# Altium schematic sheet STM32H730_PINOUT.SchDoc
size C; SheetNumber: 3; SheetTotal: 9
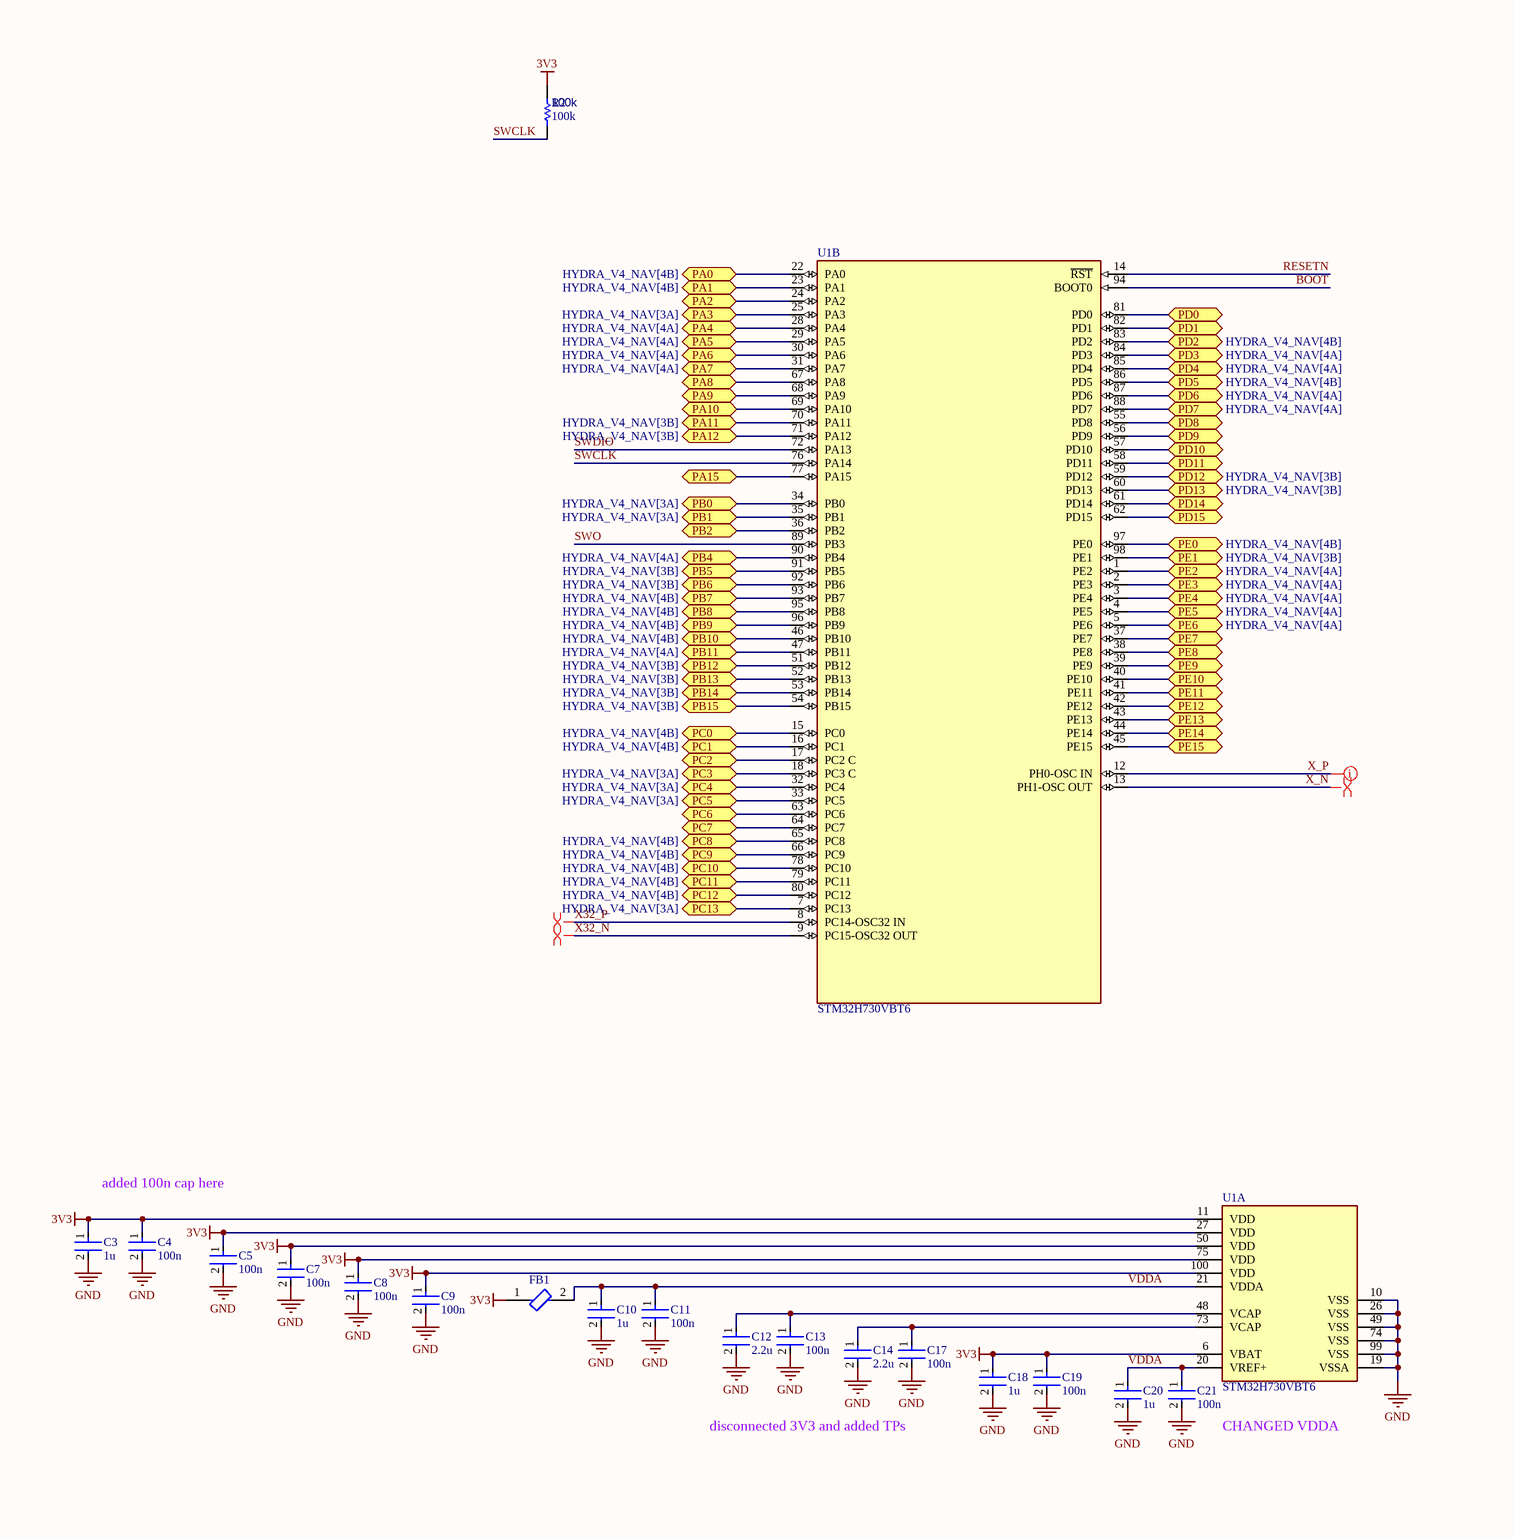
[diagram p0: STM32H730_PINOUT.SchDoc, left]
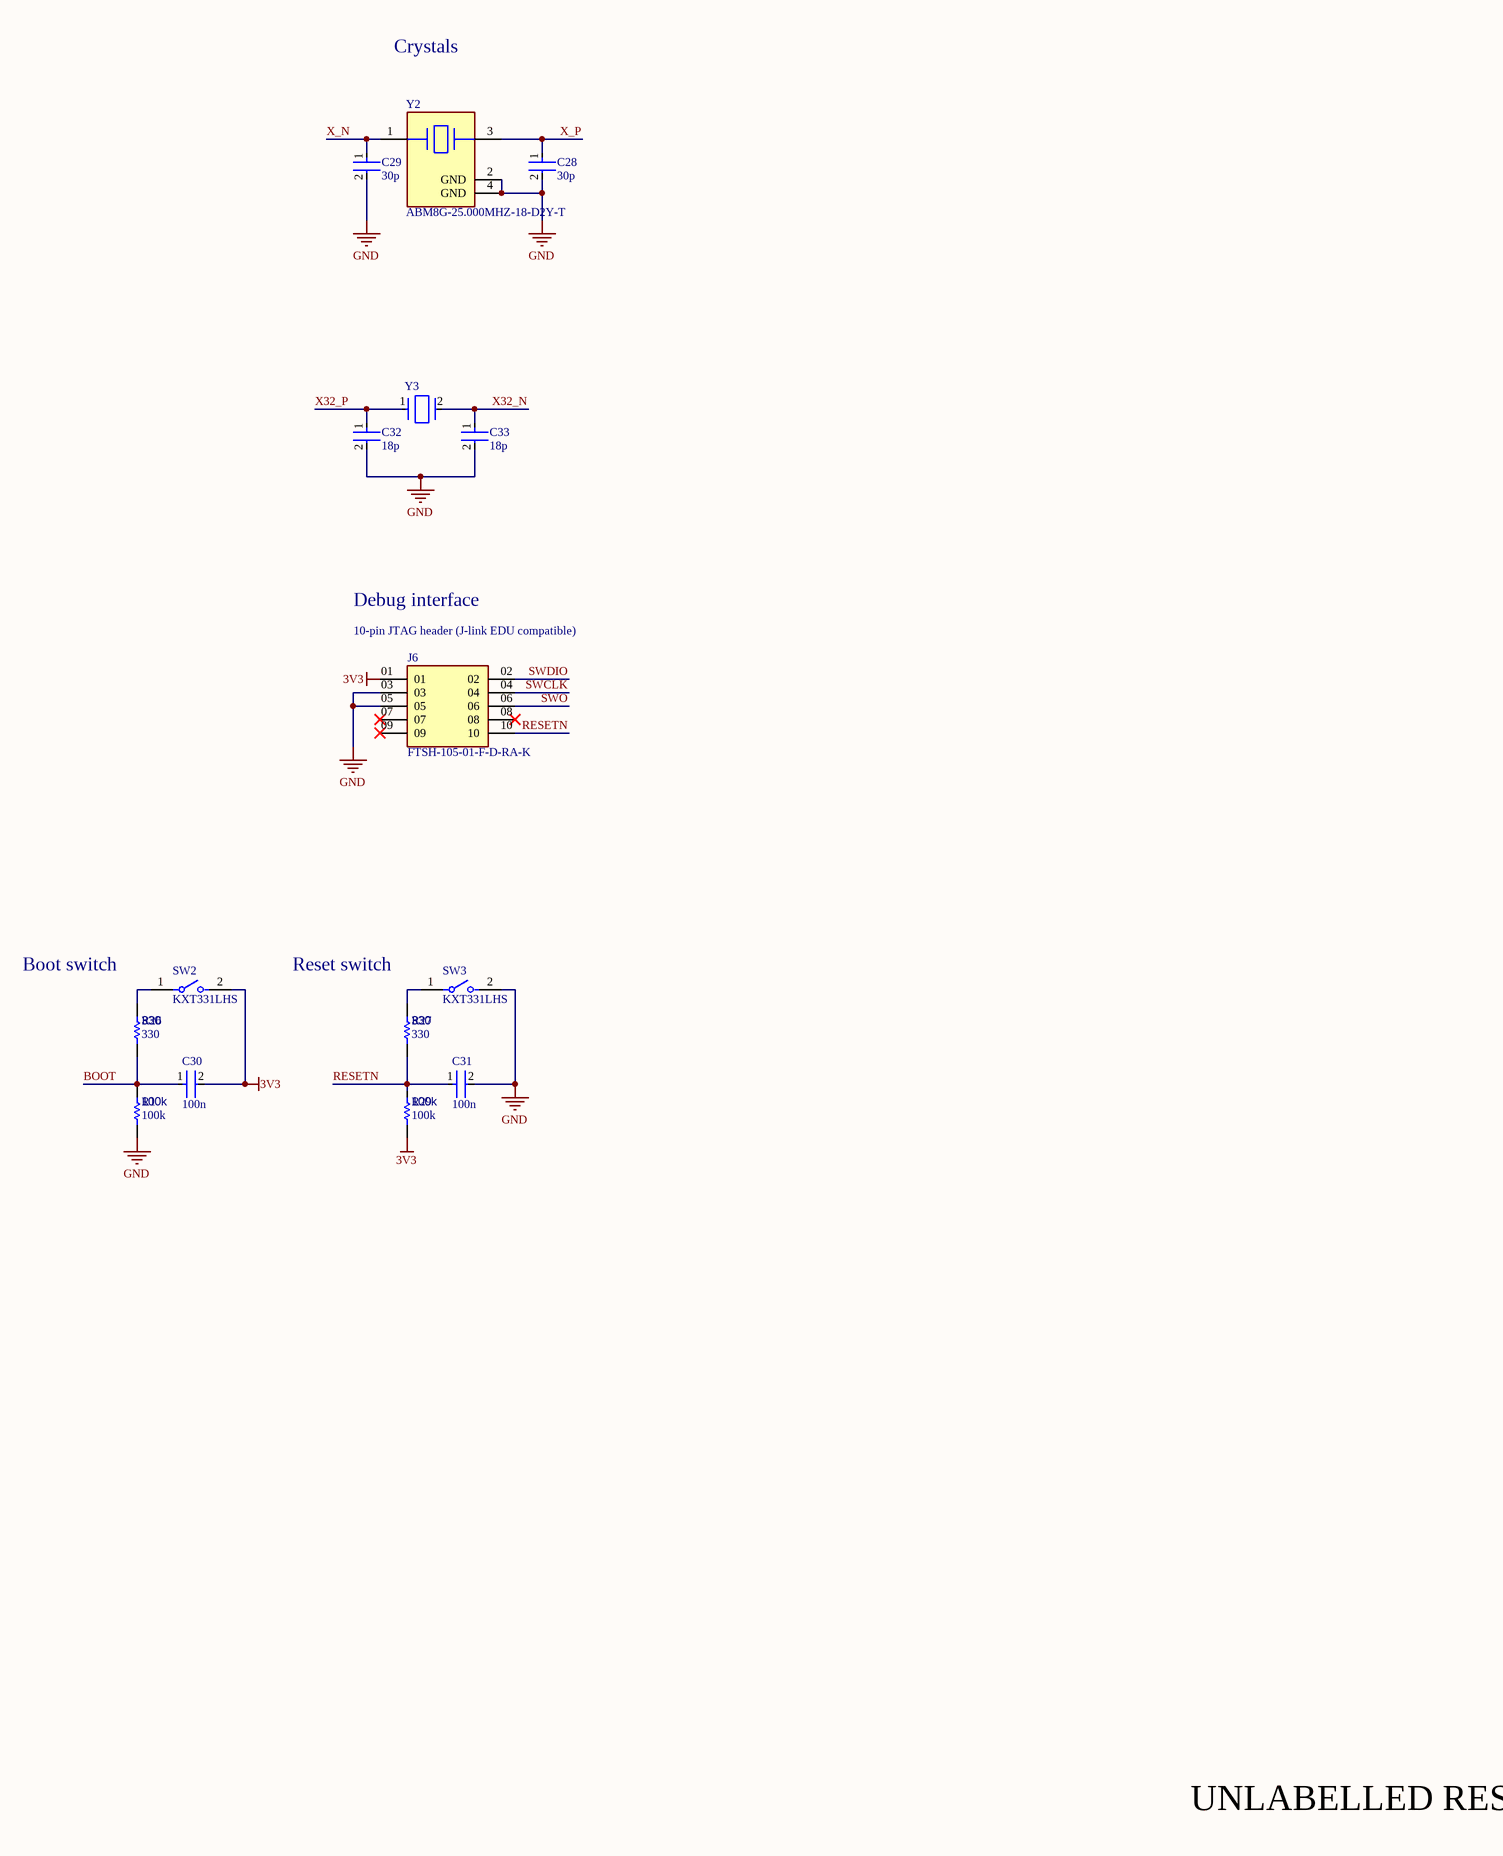
[diagram p1: STM32H730_PINOUT.SchDoc, right]

## Parts
C3  1u  [FP-0402-L_1_0_0_05-W_0_5-IPC_A]
C4  100n  [FP-0402-L_1_0_0_05-W_0_5-IPC_A]
C5  100n  [FP-0402-L_1_0_0_05-W_0_5-IPC_A]
C7  100n  [FP-0402-L_1_0_0_05-W_0_5-IPC_A]
C8  100n  [FP-0402-L_1_0_0_05-W_0_5-IPC_A]
C9  100n  [FP-0402-L_1_0_0_05-W_0_5-IPC_A]
C10  1u  [FP-0402-L_1_0_0_05-W_0_5-IPC_A]
C11  100n  [FP-0402-L_1_0_0_05-W_0_5-IPC_A]
C12  2.2u  [FP-0402-L_1_0_0_05-W_0_5-IPC_A]
C13  100n  [FP-0402-L_1_0_0_05-W_0_5-IPC_A]
C14  2.2u  [FP-0402-L_1_0_0_05-W_0_5-IPC_A]
C17  100n  [FP-0402-L_1_0_0_05-W_0_5-IPC_A]
C18  1u  [FP-0402-L_1_0_0_05-W_0_5-IPC_A]
C19  100n  [FP-0402-L_1_0_0_05-W_0_5-IPC_A]
C20  1u  [FP-0402-L_1_0_0_05-W_0_5-IPC_A]
C21  100n  [FP-0402-L_1_0_0_05-W_0_5-IPC_A]
C28  30p  [FP-0402-L_1_0_0_05-W_0_5-IPC_A]
C29  30p  [FP-0402-L_1_0_0_05-W_0_5-IPC_A]
C30  100n  [FP-0402-L_1_0_0_05-W_0_5-IPC_A]
C31  100n  [FP-0402-L_1_0_0_05-W_0_5-IPC_A]
C32  18p  [FP-0402-L_1_0_0_05-W_0_5-IPC_A]
C33  18p  [FP-0402-L_1_0_0_05-W_0_5-IPC_A]
FB1  BLM15PX601SN1D  [FP-BLM15-0_05-MFG]  (value not drawn)
J6  FTSH-105-01-F-D-RA-K  [FTSH-105-01-F-D-RA-K-Footprint-1]
R1  100k  [R0603B]
R2  100k  [R0603B]
R26  330  [R0603B]
R27  330  [R0603B]
R29  100k  [R0603B]
SW2  KXT331LHS  [FP-KXT331LHS-MFG]
SW3  KXT331LHS  [FP-KXT331LHS-MFG]
U1  STM32H730VBT6  [FP-LQFP100-1L-IPC_C]  (parts A,B of 2)
Y2  ABM8G-25.000MHZ-18-D2Y-T  [FP-ABM8G-MFG]
Y3  ECS-.327-12.5-1210-TR  [FP-ECX-1210-MFG]  (value not drawn)

## Ports
PA0 (bidir, see HYDRA_V4_NAV[4B]), PA1 (bidir, see HYDRA_V4_NAV[4B]), PA2 (bidir), PA3 (bidir, see HYDRA_V4_NAV[3A]), PA4 (bidir, see HYDRA_V4_NAV[4A]), PA5 (bidir, see HYDRA_V4_NAV[4A]), PA6 (bidir, see HYDRA_V4_NAV[4A]), PA7 (bidir, see HYDRA_V4_NAV[4A]), PA8 (bidir), PA9 (bidir), PA10 (bidir), PA11 (bidir, see HYDRA_V4_NAV[3B]), PA12 (bidir, see HYDRA_V4_NAV[3B]), PA15 (bidir), PB0 (bidir, see HYDRA_V4_NAV[3A]), PB1 (bidir, see HYDRA_V4_NAV[3A]), PB2 (bidir), PB4 (bidir, see HYDRA_V4_NAV[4A]), PB5 (bidir, see HYDRA_V4_NAV[3B]), PB6 (bidir, see HYDRA_V4_NAV[3B]), PB7 (bidir, see HYDRA_V4_NAV[4B]), PB8 (bidir, see HYDRA_V4_NAV[4B]), PB9 (bidir, see HYDRA_V4_NAV[4B]), PB10 (bidir, see HYDRA_V4_NAV[4B]), PB11 (bidir, see HYDRA_V4_NAV[4A]), PB12 (bidir, see HYDRA_V4_NAV[3B]), PB13 (bidir, see HYDRA_V4_NAV[3B]), PB14 (bidir, see HYDRA_V4_NAV[3B]), PB15 (bidir, see HYDRA_V4_NAV[3B]), PC0 (bidir, see HYDRA_V4_NAV[4B]), PC1 (bidir, see HYDRA_V4_NAV[4B]), PC2 (bidir), PC3 (bidir, see HYDRA_V4_NAV[3A]), PC4 (bidir, see HYDRA_V4_NAV[3A]), PC5 (bidir, see HYDRA_V4_NAV[3A]), PC6 (bidir), PC7 (bidir), PC8 (bidir, see HYDRA_V4_NAV[4B]), PC9 (bidir, see HYDRA_V4_NAV[4B]), PC10 (bidir, see HYDRA_V4_NAV[4B]), PC11 (bidir, see HYDRA_V4_NAV[4B]), PC12 (bidir, see HYDRA_V4_NAV[4B]), PC13 (bidir, see HYDRA_V4_NAV[3A]), PD0 (bidir), PD1 (bidir), PD2 (bidir, see HYDRA_V4_NAV[4B]), PD3 (bidir, see HYDRA_V4_NAV[4A]), PD4 (bidir, see HYDRA_V4_NAV[4A]), PD5 (bidir, see HYDRA_V4_NAV[4B]), PD6 (bidir, see HYDRA_V4_NAV[4A]), PD7 (bidir, see HYDRA_V4_NAV[4A]), PD8 (bidir), PD9 (bidir), PD10 (bidir), PD11 (bidir), PD12 (bidir, see HYDRA_V4_NAV[3B]), PD13 (bidir, see HYDRA_V4_NAV[3B]), PD14 (bidir), PD15 (bidir), PE0 (bidir, see HYDRA_V4_NAV[4B]), PE1 (bidir, see HYDRA_V4_NAV[3B]), PE2 (bidir, see HYDRA_V4_NAV[4A]), PE3 (bidir, see HYDRA_V4_NAV[4A]), PE4 (bidir, see HYDRA_V4_NAV[4A]), PE5 (bidir, see HYDRA_V4_NAV[4A]), PE6 (bidir, see HYDRA_V4_NAV[4A]), PE7 (bidir), PE8 (bidir), PE9 (bidir), PE10 (bidir), PE11 (bidir), PE12 (bidir), PE13 (bidir), PE14 (bidir), PE15 (bidir)

## Nets
3V3: C3.1 C4.1 C5.1 C7.1 C8.1 C9.1 C18.1 C19.1 C30.2 FB1.1 J6.01 R2.1 R29.2 SW2.2 U1.6(VBAT) U1.11(VDD) U1.27(VDD) U1.50(VDD) U1.75(VDD) U1.100(VDD)
GND: C3.2 C4.2 C5.2 C7.2 C8.2 C9.2 C10.2 C11.2 C12.2 C13.2 C14.2 C17.2 C18.2 C19.2 C20.2 C21.2 C28.2 C29.2 C31.2 C32.2 C33.2 J6.03 J6.05 R1.2 SW3.2 U1.10(VSS) U1.19(VSSA) U1.26(VSS) U1.49(VSS) U1.74(VSS) U1.99(VSS) Y2.2(GND) Y2.4(GND)
BOOT: C30.1 R1.1 R26.2 U1.94(BOOT0)
PA0: U1.22(PA0) ; port PA0
PA1: U1.23(PA1) ; port PA1
PA2: U1.24(PA2) ; port PA2
PA3: U1.25(PA3) ; port PA3
PA4: U1.28(PA4) ; port PA4
PA5: U1.29(PA5) ; port PA5
PA6: U1.30(PA6) ; port PA6
PA7: U1.31(PA7) ; port PA7
PA8: U1.67(PA8) ; port PA8
PA9: U1.68(PA9) ; port PA9
PA10: U1.69(PA10) ; port PA10
PA11: U1.70(PA11) ; port PA11
PA12: U1.71(PA12) ; port PA12
PA15: U1.77(PA15) ; port PA15
PB0: U1.34(PB0) ; port PB0
PB1: U1.35(PB1) ; port PB1
PB2: U1.36(PB2) ; port PB2
PB4: U1.90(PB4) ; port PB4
PB5: U1.91(PB5) ; port PB5
PB6: U1.92(PB6) ; port PB6
PB7: U1.93(PB7) ; port PB7
PB8: U1.95(PB8) ; port PB8
PB9: U1.96(PB9) ; port PB9
PB10: U1.46(PB10) ; port PB10
PB11: U1.47(PB11) ; port PB11
PB12: U1.51(PB12) ; port PB12
PB13: U1.52(PB13) ; port PB13
PB14: U1.53(PB14) ; port PB14
PB15: U1.54(PB15) ; port PB15
PC0: U1.15(PC0) ; port PC0
PC1: U1.16(PC1) ; port PC1
PC2: U1.17(PC2_C) ; port PC2
PC3: U1.18(PC3_C) ; port PC3
PC4: U1.32(PC4) ; port PC4
PC5: U1.33(PC5) ; port PC5
PC6: U1.63(PC6) ; port PC6
PC7: U1.64(PC7) ; port PC7
PC8: U1.65(PC8) ; port PC8
PC9: U1.66(PC9) ; port PC9
PC10: U1.78(PC10) ; port PC10
PC11: U1.79(PC11) ; port PC11
PC12: U1.80(PC12) ; port PC12
PC13: U1.7(PC13) ; port PC13
PD0: U1.81(PD0) ; port PD0
PD1: U1.82(PD1) ; port PD1
PD2: U1.83(PD2) ; port PD2
PD3: U1.84(PD3) ; port PD3
PD4: U1.85(PD4) ; port PD4
PD5: U1.86(PD5) ; port PD5
PD6: U1.87(PD6) ; port PD6
PD7: U1.88(PD7) ; port PD7
PD8: U1.55(PD8) ; port PD8
PD9: U1.56(PD9) ; port PD9
PD10: U1.57(PD10) ; port PD10
PD11: U1.58(PD11) ; port PD11
PD12: U1.59(PD12) ; port PD12
PD13: U1.60(PD13) ; port PD13
PD14: U1.61(PD14) ; port PD14
PD15: U1.62(PD15) ; port PD15
PE0: U1.97(PE0) ; port PE0
PE1: U1.98(PE1) ; port PE1
PE2: U1.1(PE2) ; port PE2
PE3: U1.2(PE3) ; port PE3
PE4: U1.3(PE4) ; port PE4
PE5: U1.4(PE5) ; port PE5
PE6: U1.5(PE6) ; port PE6
PE7: U1.37(PE7) ; port PE7
PE8: U1.38(PE8) ; port PE8
PE9: U1.39(PE9) ; port PE9
PE10: U1.40(PE10) ; port PE10
PE11: U1.41(PE11) ; port PE11
PE12: U1.42(PE12) ; port PE12
PE13: U1.43(PE13) ; port PE13
PE14: U1.44(PE14) ; port PE14
PE15: U1.45(PE15) ; port PE15
RESETN: C31.1 J6.10 R27.2 R29.1 U1.14(~{RST})
SWCLK: J6.04 R2.2 U1.76(PA14)
SWDIO: J6.02 U1.72(PA13)
SWO: J6.06 U1.89(PB3)
VDDA: C10.1 C11.1 C20.1 C21.1 FB1.2 U1.20(VREF+) U1.21(VDDA)
X32_N: C33.1 U1.9(PC15-OSC32_OUT) Y3.2(Out/In)
X32_P: C32.1 U1.8(PC14-OSC32_IN) Y3.1(In/Out)
X_N: C29.1 U1.13(PH1-OSC_OUT) Y2.1
X_P: C28.1 U1.12(PH0-OSC_IN) Y2.3
NetC12_1: C12.1 C13.1 U1.48(VCAP)
NetC14_1: C14.1 C17.1 U1.73(VCAP)
NetR26_1: R26.1 SW2.1
NetR27_1: R27.1 SW3.1

Not connected (* = marked no-connect by the designer): J6 07* 08* 09*

## Layout directives
differential pair: X32_N, X32_P, X_N, X_P

## Notes on the sheet
- Crystals
- Debug interface
- (near J6) 10-pin JTAG header (J-link EDU compatible)
- Boot switch
- Reset switch
- added 100n cap here
- disconnected 3V3 and added TPs
- CHANGED VDDA
- UNLABELLED RESISTORS ARE JUMPERS

## Library data of the parts
C3-C5 C7-C14 C17-C21 C28-C33 = CMP-001-00058-1: LARGE PADS, 0402 CAP, CHANGE COMMENT TO MATCH REAL P/N; Capacitor Type: Ceramic; Min Operating Temperature: -55°C; Mounting Technology: Surface Mount; Pins: 2; Case/Package: 0402; RoHS Compliant: Yes; Max Operating Temperature: 85°C
  C3 C10 C18 C20: Value: 1u
  C4 C5 C7-C9 C11 C13 C17 C19 C21 C30 C31: Value: 100n
  C12 C14: Value: 2.2u
  C28 C29: Value: 30p
  C32 C33: Value: 18p
FB1 = CMP-0686-00252-4: Chip Ferrite Bead, 0402, 600Ω @ 100MHz, 0.23Ω, 25%, 900mA; Number of Circuits: 1; Impedance: 600R; DC Resistance (DCR): 230mR; Material: Steel; Length: 1mm; Package Quantity: 10000; Height: 0.5mm; Width: 0.5mm; Max DC Current: 900mA; Number of Lines: 1; Termination: SMD/SMT; Packaging: Tape and Reel; Lead Free: Lead Free; Min Operating Temperature: -55°C; Max Operating Temperature: 125°C; Max Current Rating: 900mA; Case Code (Imperial): 0402; Number of Pins: 2; Current Rating: 900mA; Test Frequency: 100MHz; Case/Package: 0402; Tolerance: 25%; Case Code (Metric): 1005
J6 = CMP-002-00041-5: Board Connector, 10 Contact(s), 2 Row(s), Male, Right Angle, 0.05 inch Pitch, Surface Mount Terminal, Locking, Black Insulator; Connector Type: BOARD CONNECTOR; Mounting Technology: Board; RoHS Compliant: Yes
R1 R2 R26 R27 R29 = CMP-009-00002-14: Resistor
  R1 R2 R29: Value: 100k
  R26 R27: Value: 330
SW2 SW3 = CMP-10040-000029-1: SWITCH TACTILE SPST-NO 0.02A 15V; Operating Force: 240gf; Switch Travel: 0.13mm; Illumination Type: Non-Illuminated; Throw Configuration: SPST; Number of Ports: 1; Current Rating: 5A; Mechanical Life: 500000Cycles; Switch Function: Off-Mom; Connector Type: USB; Actuator Type: Standard; Gender: Receptacle; Number of Contacts: 24; Contact Plating: Gold; Insulation Color: Black; Min Operating Temperature: -40°C; Packaging: Tape and Reel; Flammability Rating: UL94 V-0; Max Operating Temperature: 85°C; Termination: Solder; Mount: Surface Mount
U1 = CMP-12105-000107-1: IC MCU 32BIT 128KB FLASH 100LQFP
Y2 = CMP-2000-05733-3: Crystal 25MHz ±20ppm (Tol) ±30ppm (Stability) 18pF FUND 60Ω 4-Pin SMD T/R; Series Resistance: 60R; Length: 3.2mm; Depth: 2.5mm; Packaging: Tape and Reel; Min Operating Temperature: -40°C; Operating Frequency: 25 MHz; Lead Free: Lead Free; Number of Pins: 4; Frequency Tolerance: 20ppm; Radiation Hardening: No; Max Operating Temperature: 85°C; Termination: SMD/SMT; Frequency Stability: 30ppm; Frequency: 25MHz; Series: ABM8G; Mount: Surface Mount; Package Quantity: 1000; Height: 0.039inch; Width: 0.098inch; Case/Package: CSMD; ESR (Equivalent Series Resistance): 60R; Load Capacitance: 18pF; Tolerance: 20ppm
Y3 = CMP-40224-000006-1: CRYSTAL 32.7680KHZ 12.5PF SMD; Manufacturer: ECS International; Frequency: 32.768kHz; Esr: 90kΩ; Tolerance: 20ppm; Device Class L1: Passive Components; Load Capacitance: 12.5pF; Temperature: -40°C to +85°C; ComponentLink2URL: https://ecsxtal.com/store/pdf/ECX-1210.pdf; Series: ECX-1210; Octopart: https://octopart.com/ecs-.327-12.5-1210-tr-ecs+international-81221340; ComponentLink2Description: Datasheet; Temperature Range Low: -40°C; Digikey Description: CRYSTAL 32.7680KHZ 12.5PF SMD; Lead Free: Yes; RoHS: TRUE; Device Class L3: Crystals; Automotive: No; Category: Crys; Height: 0.5mm; Manufacturer Part Number: ECS-.327-12.5-1210-TR; Temperature Range High: +85°C; Device Class L2: Crystals / Oscillators; Package: ECX-1210